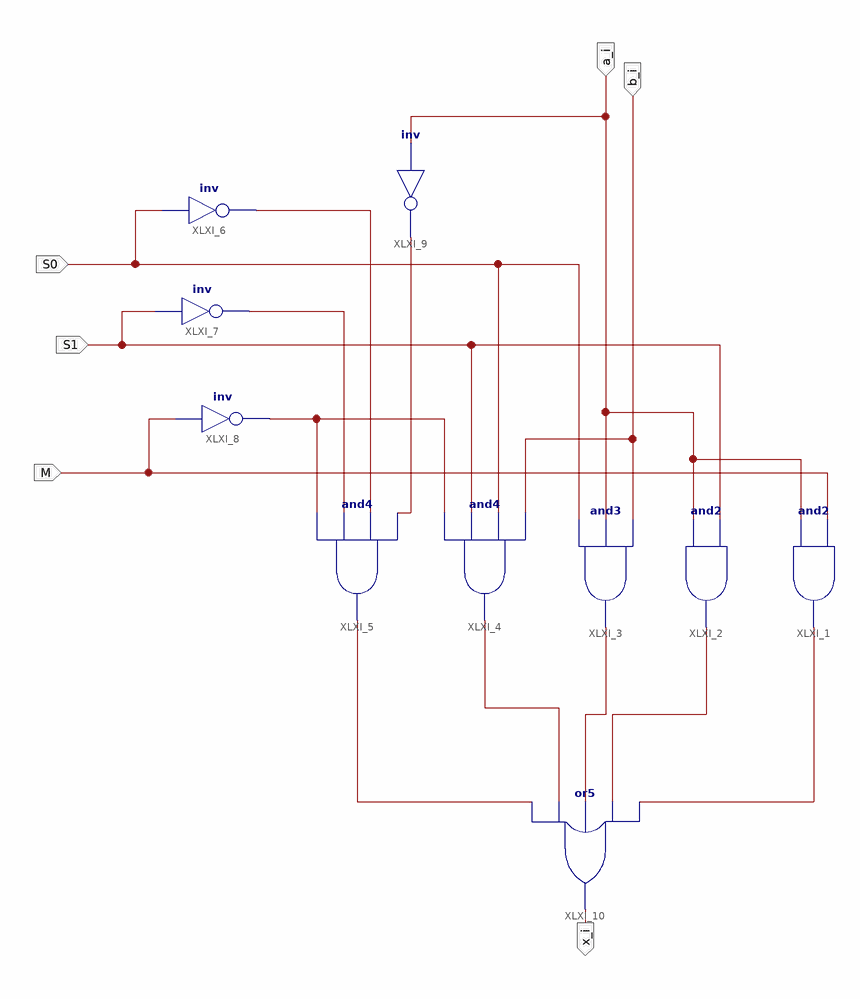
[diagram p0: schematic sheet 1]
// Xilinx ISE schematic logic_extender.sch (spartan3e) as structural Verilog: 10 symbols, 6 ports
module logic_extender (
  input  a_i,
  input  S0,
  input  S1,
  input  M,
  input  b_i,
  output x_i
);

  wire XLXN_1, XLXN_2, XLXN_3, XLXN_4, XLXN_5, XLXN_8, XLXN_13, XLXN_14, XLXN_15;

  and XLXI_1 (XLXN_5, a_i, M);
  and XLXI_2 (XLXN_4, a_i, S1);
  and XLXI_3 (XLXN_3, S0, a_i, b_i);
  and XLXI_4 (XLXN_2, XLXN_15, S1, S0, b_i);
  and XLXI_5 (XLXN_1, XLXN_15, XLXN_14, XLXN_13, XLXN_8);
  not XLXI_6 (XLXN_13, S0);
  not XLXI_7 (XLXN_14, S1);
  not XLXI_8 (XLXN_15, M);
  not XLXI_9 (XLXN_8, a_i);
  or XLXI_10 (x_i, XLXN_1, XLXN_2, XLXN_3, XLXN_4, XLXN_5);
endmodule
